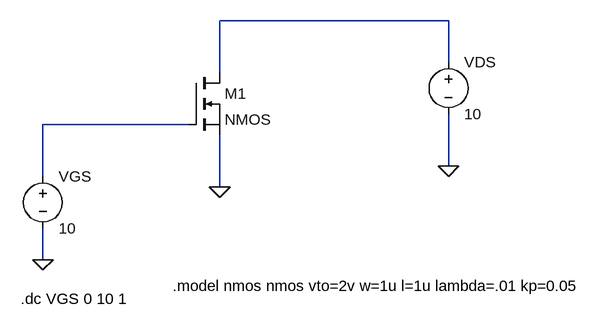
[diagram p0: schematic Draft2.asc]
Draft2.asc, the LTspice schematic file:
Version 4
SHEET 1 880 680
WIRE 512 -32 160 -32
WIRE 512 32 512 -32
WIRE 160 48 160 -32
WIRE 112 128 -112 128
WIRE 512 192 512 112
WIRE -112 208 -112 128
WIRE 160 224 160 144
WIRE -112 336 -112 288
FLAG -112 336 0
FLAG 160 224 0
FLAG 512 192 0
SYMBOL nmos 112 48 R0
SYMATTR InstName M1
SYMBOL voltage -112 192 R0
WINDOW 123 0 0 Left 0
WINDOW 39 0 0 Left 0
SYMATTR InstName VGS
SYMATTR Value 10
SYMBOL voltage 512 16 R0
WINDOW 123 0 0 Left 0
WINDOW 39 0 0 Left 0
SYMATTR InstName VDS
SYMATTR Value 10
TEXT 88 376 Left 2 !.model nmos nmos vto=2v w=1u l=1u lambda=.01 kp=0.05
TEXT -146 396 Left 2 !.dc VGS 0 10 1

The netlist it stands for:
* Draft2.asc
M1 N001 N002 0 0 NMOS
VGS N002 0 10
VDS N001 0 10
.model NMOS NMOS
.model PMOS PMOS
.lib standard.mos
.model nmos nmos vto=2v w=1u l=1u lambda=.01 kp=0.05
.dc VGS 0 10 1
.backanno
.end